# Altium schematic sheet RpPicoW.SchDoc
size A4; SheetNumber: 2; SheetTotal: 4
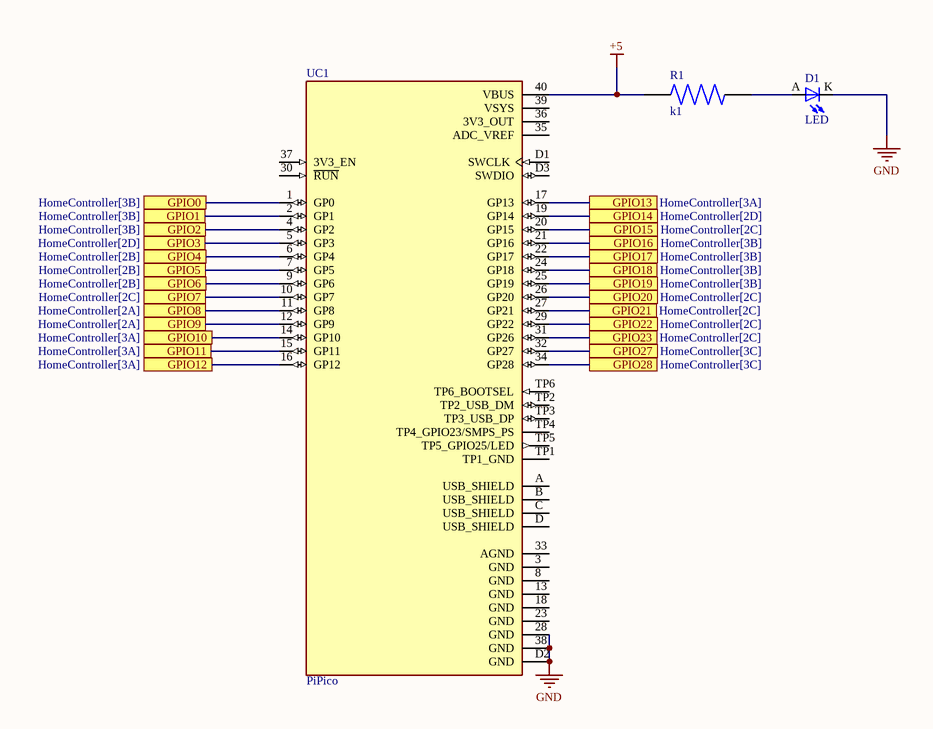
[diagram p0: RpPicoW.SchDoc]

## Parts
D1  LED  [New footprint 1]
R1  k1  [Resistor]
UC1  PiPico  [PiPico]

## Ports
GPIO0 (see HomeController[3B]), GPIO1 (see HomeController[3B]), GPIO2 (see HomeController[3B]), GPIO3 (see HomeController[2D]), GPIO4 (see HomeController[2B]), GPIO5 (see HomeController[2B]), GPIO6 (see HomeController[2B]), GPIO7 (see HomeController[2C]), GPIO8 (see HomeController[2A]), GPIO9 (see HomeController[2A]), GPIO10 (see HomeController[3A]), GPIO11 (see HomeController[3A]), GPIO12 (see HomeController[3A]), GPIO13 (see HomeController[3A]), GPIO14 (see HomeController[2D]), GPIO15 (see HomeController[2C]), GPIO16 (see HomeController[3B]), GPIO17 (see HomeController[3B]), GPIO18 (see HomeController[3B]), GPIO19 (see HomeController[3B]), GPIO20 (see HomeController[2C]), GPIO21 (see HomeController[2C]), GPIO22 (see HomeController[2C]), GPIO23 (see HomeController[2C]), GPIO27 (see HomeController[3C]), GPIO28 (see HomeController[3C])

## Nets
+5: R1.1 UC1.40(VBUS)
GND: D1.K UC1.28(GND) UC1.38(GND) UC1.D2(GND)
GPIO0: UC1.1(GP0) ; port GPIO0
GPIO1: UC1.2(GP1) ; port GPIO1
GPIO2: UC1.4(GP2) ; port GPIO2
GPIO3: UC1.5(GP3) ; port GPIO3
GPIO4: UC1.6(GP4) ; port GPIO4
GPIO5: UC1.7(GP5) ; port GPIO5
GPIO6: UC1.9(GP6) ; port GPIO6
GPIO7: UC1.10(GP7) ; port GPIO7
GPIO8: UC1.11(GP8) ; port GPIO8
GPIO9: UC1.12(GP9) ; port GPIO9
GPIO10: UC1.14(GP10) ; port GPIO10
GPIO11: UC1.15(GP11) ; port GPIO11
GPIO12: UC1.16(GP12) ; port GPIO12
GPIO13: UC1.17(GP13) ; port GPIO13
GPIO14: UC1.19(GP14) ; port GPIO14
GPIO15: UC1.20(GP15) ; port GPIO15
GPIO16: UC1.21(GP16) ; port GPIO16
GPIO17: UC1.22(GP17) ; port GPIO17
GPIO18: UC1.24(GP18) ; port GPIO18
GPIO19: UC1.25(GP19) ; port GPIO19
GPIO20: UC1.26(GP20) ; port GPIO20
GPIO21: UC1.27(GP21) ; port GPIO21
GPIO22: UC1.29(GP22) ; port GPIO22
GPIO23: UC1.31(GP26) ; port GPIO23
GPIO27: UC1.32(GP27) ; port GPIO27
GPIO28: UC1.34(GP28) ; port GPIO28
NetD1_A: D1.A R1.2

Not connected (* = marked no-connect by the designer): UC1 3(GND) 8(GND) 13(GND) 18(GND) 23(GND) 30(~{RUN}) 33(AGND) 35(ADC_VREF) 36(3V3_OUT) 37(3V3_EN) 39(VSYS) A(USB_SHIELD) B(USB_SHIELD) C(USB_SHIELD) D(USB_SHIELD) D1(SWCLK) D3(SWDIO) TP1(TP1_GND) TP2(TP2_USB_DM) TP3(TP3_USB_DP) TP4(TP4_GPIO23/SMPS_PS) TP5(TP5_GPIO25/LED) TP6(TP6_BOOTSEL)

## Library data of the parts
D1 = CMP-00001-2: 3mm LED
R1 = Resistor